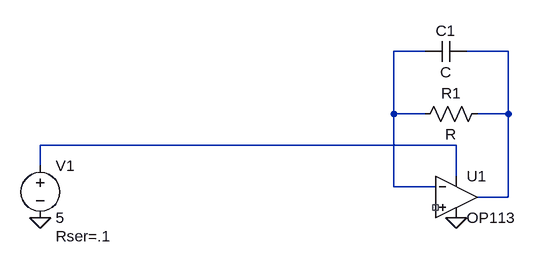
[diagram p0: schematic Filter.asc]
Filter.asc, the LTspice schematic file:
Version 4
SHEET 1 880 680
WIRE 208 -32 160 -32
WIRE 336 -32 272 -32
WIRE 160 64 160 -32
WIRE 208 64 160 64
WIRE 336 64 336 -32
WIRE 336 64 288 64
WIRE 256 112 -384 112
WIRE -384 144 -384 112
WIRE 256 160 256 112
WIRE 160 176 160 64
WIRE 224 176 160 176
WIRE 336 192 336 64
WIRE 336 192 288 192
FLAG 256 224 0
FLAG -384 224 0
SYMBOL Opamps\\OP113 256 128 R0
SYMATTR InstName U1
SYMBOL voltage -384 128 R0
WINDOW 123 0 0 Left 0
WINDOW 39 24 124 Left 2
SYMATTR InstName V1
SYMATTR Value 5
SYMATTR SpiceLine Rser=.1
SYMBOL res 304 48 R90
WINDOW 0 0 56 VBottom 2
WINDOW 3 32 56 VTop 2
SYMATTR InstName R1
SYMBOL cap 272 -48 R90
WINDOW 0 0 32 VBottom 2
WINDOW 3 32 32 VTop 2
SYMATTR InstName C1

The netlist it stands for:
* Filter.asc
XU1 NC_01 N001 N003 0 N002 OP113  ; pins In+ In- V+ V- OUT
V1 N003 0 5 Rser=.1
R1 N002 N001 R
C1 N002 N001 C
.lib ADI.lib
.backanno
.end